# Altium schematic sheet E3Z 电子器件位置 - 20251224.SchDoc
size A2
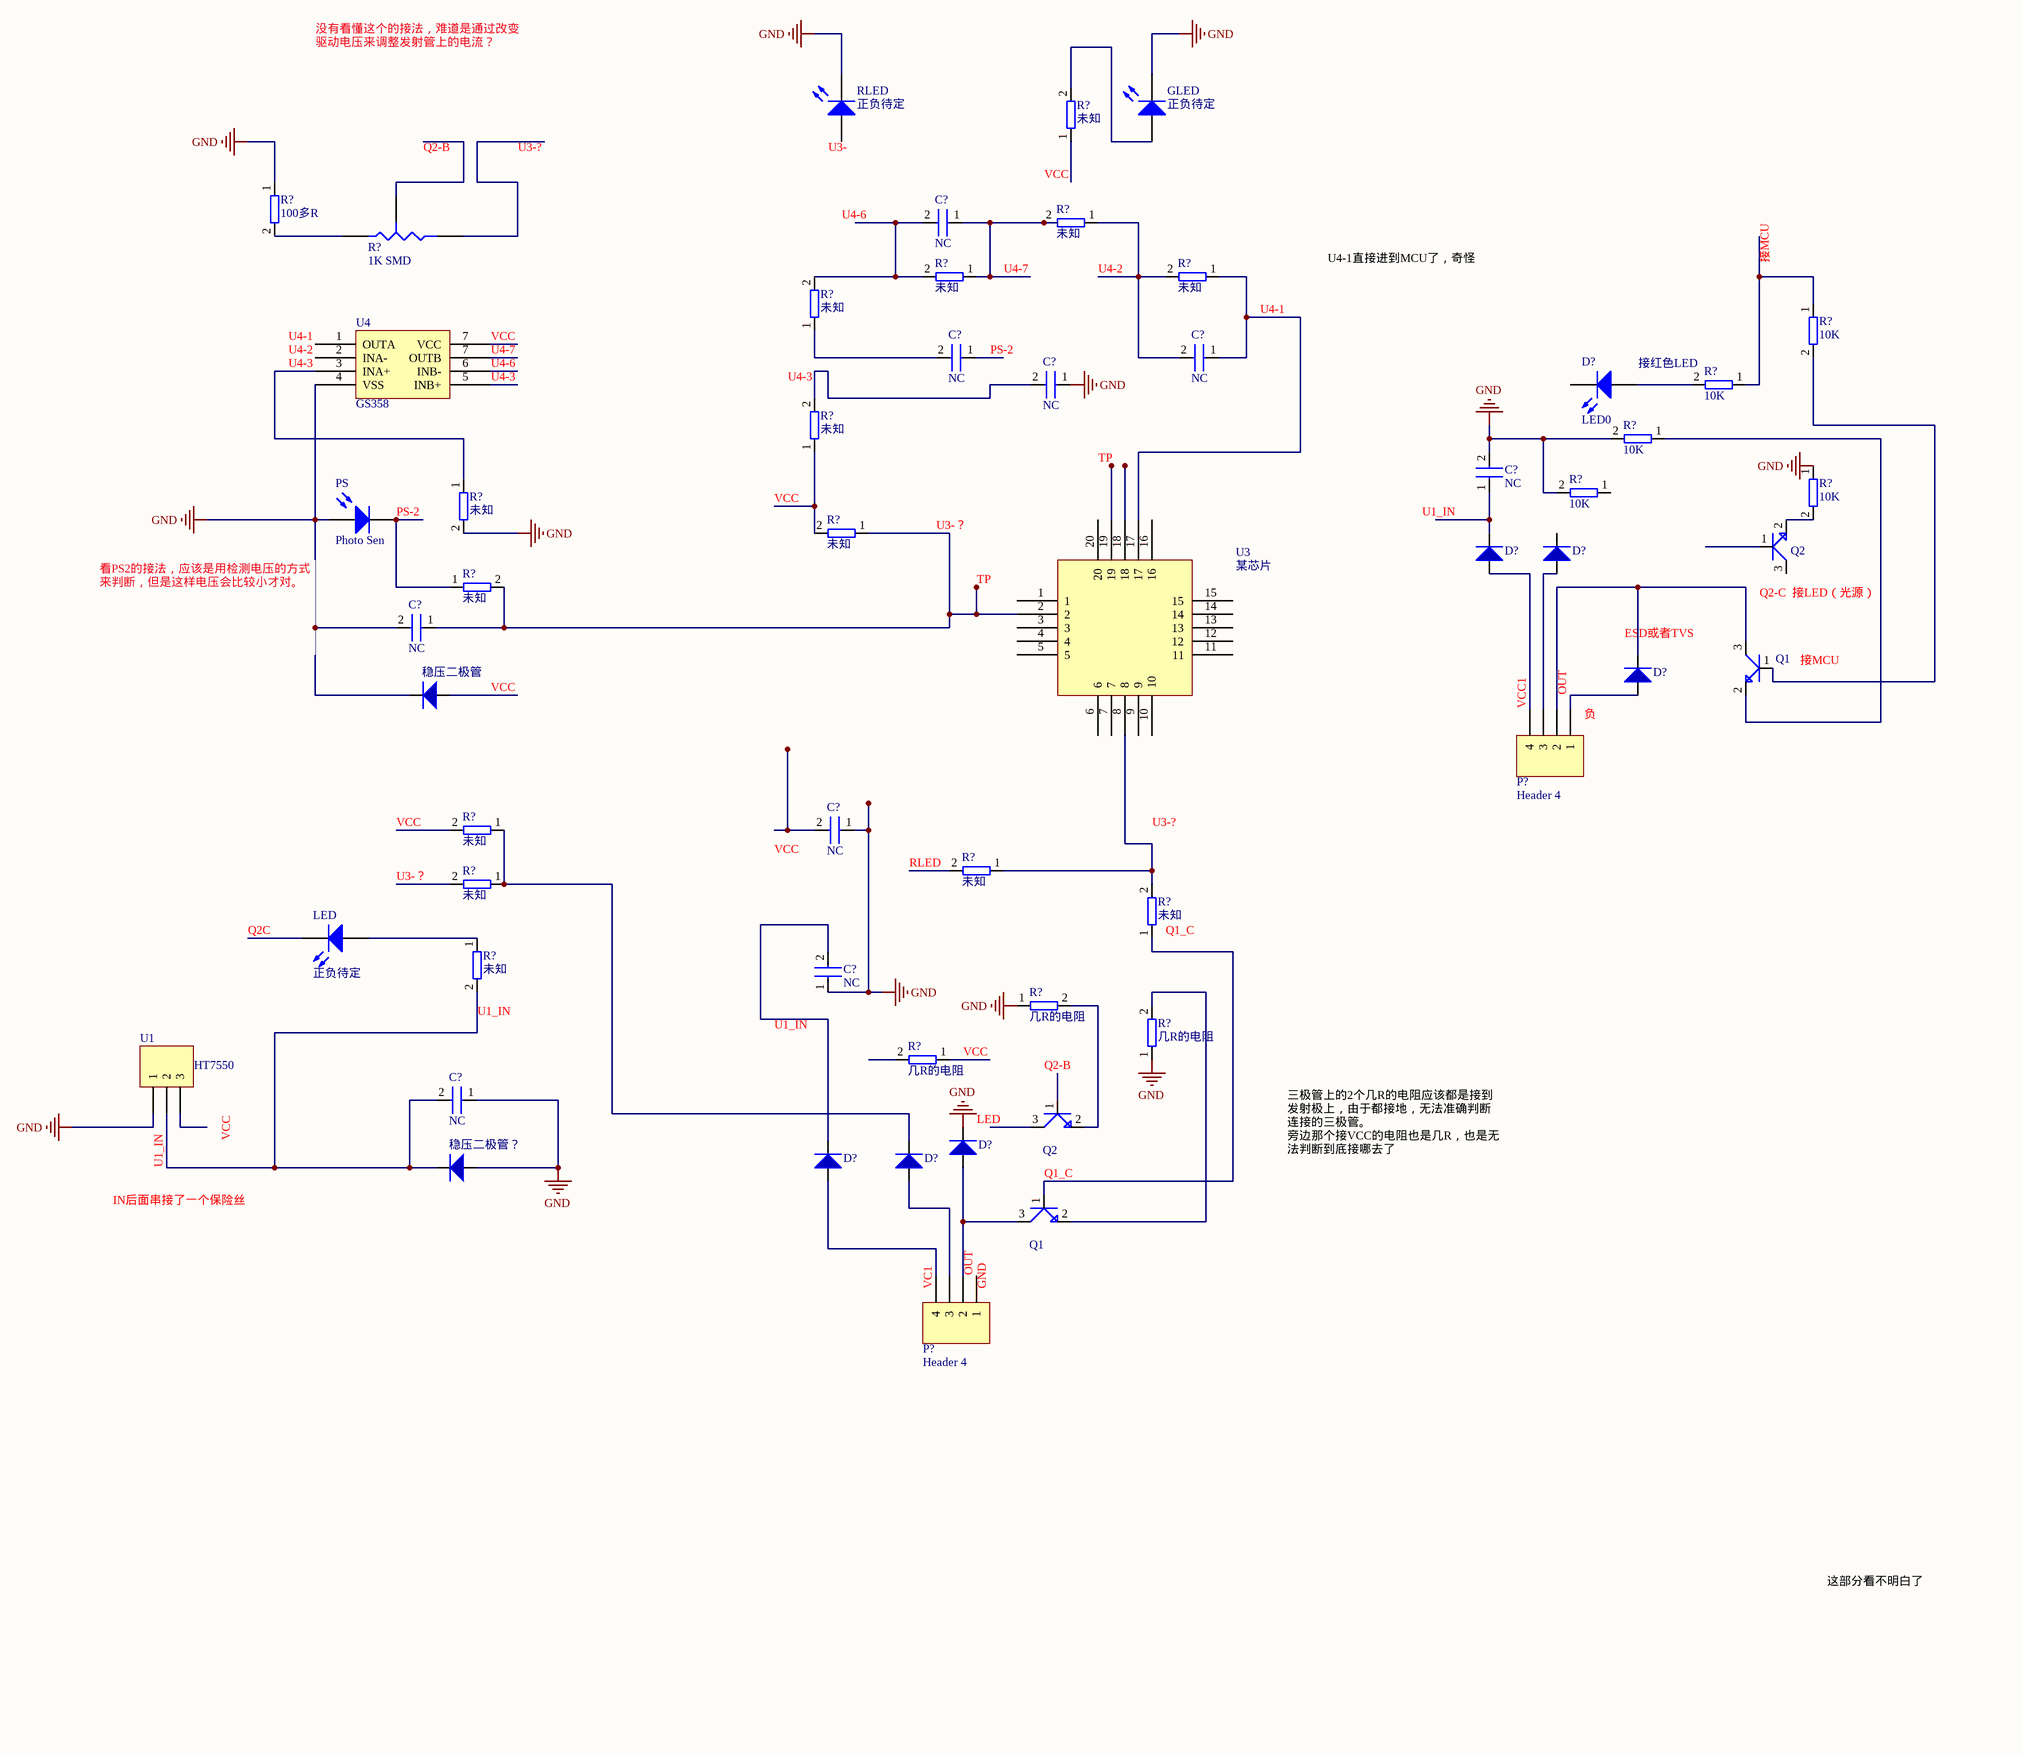
[diagram p0: E3Z 电子器件位置 - 20251224.SchDoc]

## Parts
(Parts that share a designator on the sheet are numbered #1, #2 ... from top to bottom, then left to right.)
C?#1  NC
C?#2  NC
C?#3  NC
C?#4  NC
C?#5  NC
C?#6  NC
C?#7  NC
C?#8  NC
C?#9  NC
D?#1  LED0  [LED-0]
D?#2  (no value)
D?#3  (no value)
D?#4  (no value)
D?#5  (no value)
D?#6  (no value)
D?#7  (no value)
GLED  正负待定  [LED-0]
LED  正负待定  [LED-0]
P?#1  Header 4  [HDR1X4]
P?#2  Header 4  [HDR1X4]
PS  Photo Sen  [PIN2]
Q1#1  2SC4617TLR  (value not drawn)
Q1#2  2SC4617TLR  (value not drawn)
Q2#1  2SC4617TLR  (value not drawn)
Q2#2  2SC4617TLR  (value not drawn)
R?#1  未知
R?#2  100多R
R?#3  value 1K SMD  [VR3]  (hidden comment: Res Tap)
R?#4  未知
R?#5  未知
R?#6  未知
R?#7  10K
R?#8  未知
R?#9  10K
R?#10  10K
R?#11  未知
R?#12  10K
R?#13  未知
R?#14  10K
R?#15  未知
R?#16  未知
R?#17  未知
R?#18  未知
R?#19  未知
R?#20  未知
R?#21  未知
R?#22  几R的电阻
R?#23  几R的电阻
R?#24  几R的电阻
RLED  正负待定  [LED-0]
U1  HT7550  [HDR1X3]
U3  某芯片
U4  GS358
稳压二极管  (no value)
稳压二极管？  (no value)

## Nets
GND: C?#4.1 C?#5.2 C?#6.2 C?#7.1 C?#8.1 C?#9.1 D?#5.2 GLED.2(K) PS.1(A) R?#2.1 R?#10.2 R?#12.1 R?#13.2 R?#14.2 R?#22.1 R?#24.1 RLED.2(K) U1.1 U4.4(VSS) 稳压二极管.2 稳压二极管？.1
NetC?#1_1: C?#1.1 R?#4.2 R?#5.1
NetC?#1_2: C?#1.2 R?#5.2 R?#8.2
NetC?#2_2: C?#2.2 R?#8.1
NetC?#3_1: C?#3.1 R?#6.1 U3.17
NetC?#3_2: C?#3.2 R?#4.1 R?#6.2
NetC?#4_2: C?#4.2 R?#11.2
NetC?#5_1: C?#5.1 D?#2.2
NetC?#6_1: C?#6.1 R?#15.1 R?#16.2 U3.2
NetC?#8_2: C?#8.2 D?#6.2
NetC?#9_2: C?#9.2 R?#20.2 U1.2 稳压二极管？.2
NetD?#1_1: D?#1.1(A) R?#9.2
NetD?#2_1: D?#2.1 P?#1.4
NetD?#3_1: D?#3.1 P?#1.3
NetD?#4_1: D?#4.1 P?#1.1
NetD?#4_2: D?#4.2 P?#1.2 Q1#1.3(C)
NetD?#5_1: D?#5.1 P?#2.2 Q1#2.3(C)
NetD?#6_1: D?#6.1 P?#2.4
NetD?#7_1: D?#7.1 P?#2.3
NetD?#7_2: D?#7.2 R?#17.1 R?#19.1
NetGLED_1: GLED.1(A) R?#1.2
NetLED_1: LED.1(A) R?#20.1
NetPS_2: PS.2(K) R?#16.1
NetQ1#1_1: Q1#1.1(B) R?#7.2
NetQ1#1_2: Q1#1.2(E) R?#10.1
NetQ1#2_1: Q1#2.1(B) R?#21.1
NetQ1#2_2: Q1#2.2(E) R?#24.2
NetQ2#1_2: Q2#1.2(E) R?#12.2
NetQ2#2_2: Q2#2.2(E) R?#22.2
NetR?#2_2: R?#2.2 R?#3.1(A)
NetR?#7_1: R?#7.1 R?#9.1
NetR?#11_1: R?#11.1 R?#15.2
NetR?#13_1: R?#13.1 U4.3(INA+)
NetR?#18_1: R?#18.1 R?#21.2 U3.8

Not connected (* = marked no-connect by the designer): C?#2 1; C?#7 2; D?#1 2(K); D?#3 2; LED 2(K); P?#2 1; Q2#1 1(B) 3(C); Q2#2 1(B) 3(C); R?#1 1; R?#3 2(B) 3(TAP); R?#14 1; R?#17 2; R?#18 2; R?#19 2; R?#23 1 2; RLED 1(A); U1 3; U3 1 3 4 5 6 7 9 10 11 12 13 14 15 16 18 19 20; U4 1(OUTA) 2(INA-) 5(INB+) 6(INB-) 7(OUTB); 稳压二极管 1

## Notes on the sheet
- 没有看懂这个的接法，难道是通过改变驱动电压来调整发射管上的电流？
- Q2-B
- U3-?
- (near RLED) U3-
- (near R?#4) VCC
- U4-6
- (near R?#5) U4-7
- (near R?#4) U4-2
- 接MCU
- (near U4) U4-1
- (near U4) VCC
- U4-1
- U4-1直接进到MCU了，奇怪
- (near U4) U4-3
- (near U4) U4-2
- (near U4) U4-6
- (near U4) U4-7
- (near R?#11) U4-3
- (near C?#2) PS-2
- 接红色LED
- TP
- PS-2
- (near R?#15) VCC
- U3-？
- U1_IN
- (near Q2#1) Q2-C  接LED（光源）
- 看PS2的接法，应该是用检测电压的方式来判断，但是这样电压会比较小才对。
- (near D?#4) ESD或者TVS
- (near Q1#1) 接MCU
- VCC
- (near P?#1) VCC1
- (near P?#1) OUT
- (near P?#1) 负
- (near R?#17) VCC
- (near R?#19) U3-？
- (near C?#7) VCC
- (near R?#18) RLED
- Q2C
- (near R?#21) Q1_C
- (near R?#20) U1_IN
- (near C?#8) U1_IN
- (near R?#23) VCC
- (near D?#5) LED
- IN后面串接了一个保险丝
- (near U1) U1_IN
- Q1_C
- 三极管上的2个几R的电阻应该都是接到发射极上，由于都接地，无法准确判断连接的三极管。
  旁边那个接VCC的电阻也是几R，也是无法判断到底接哪去了
- (near P?#2) VC1
- (near P?#2) OUT
- (near P?#2) GND
- 这部分看不明白了

## Library data of the parts
C?#1-C?#9 = CAP
D?#1 GLED LED RLED = LED0: Typical INFRARED GaAs LED; Published: 8-Jun-2000; LatestRevisionDate: 08-Jul-2005; LatestRevisionNote: Mech Layer 1 removed.; PackageReference: LED-0; Publisher: Altium Limited; PackageDescription: LED; 2 Leads
D?#2-D?#7 稳压二极管 稳压二极管？ = D
P?#1 P?#2 = Header 4: Header, 4-Pin; LatestRevisionDate: 17-Jul-2002; LatestRevisionNote: Re-released for DXP Platform.; Publisher: Altium Limited
PS = Photo Sen: Photosensitive Diode; Published: 24-Mar-1999; LatestRevisionDate: 17-Jul-2002; LatestRevisionNote: Re-released for DXP Platform.; PackageReference: PIN2; Publisher: Altium Limited
Q1#1 Q1#2 Q2#1 Q2#2 = 2SC4617
R?#1 R?#2 R?#4-R?#24 = RES
R?#3 = Res Tap: Tapped Resistor; Sim Note: Enter the Resistance value and the set point into parameter fields.; Set Position: 0.5; Published: 24-Mar-1999; LatestRevisionDate: 17-Jul-2002; LatestRevisionNote: Re-released for DXP Platform.; PackageReference: VR3; Publisher: Altium Limited; PackageDescription: Variable Resistor, Thru-Hole; 3 Leads
U1 = Header 3: Header, 3-Pin; LatestRevisionDate: 17-Jul-2002; LatestRevisionNote: Re-released for DXP Platform.; Publisher: Altium Limited